# EAGLE design arduinoSPIprog (EAGLE 6.4)
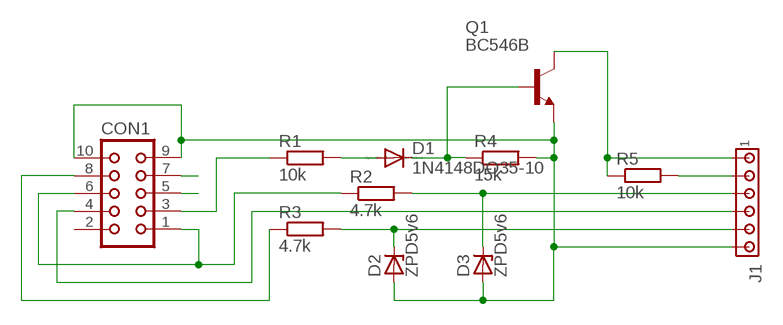
[diagram p0: schematic, sheet 1]

## Parts
CON1  CON10  [CON10]
D1  1N4148DO35-10  [DO35-10]
D2  ZPD5v6  ZPD  [DO35Z10]
D3  ZPD5v6  ZPD  [DO35Z10]
J1  MTA06-100  [10X06MTA]
Q1  BC546B  [TO92-EBC]
R1  10k  R-EU_0207/10  [0207/10]
R2  4.7k  R-EU_0207/10  [0207/10]
R3  4.7k  R-EU_0207/10  [0207/10]
R4  15k  R-EU_0207/10  [0207/10]
R5  10k  R-EU_0207/10  [0207/10]

## Nets
5V: J1.5 R5.2
CTS/MISO: CON1.4 J1.3
DSR+RTS/SCK: CON1.1 CON1.6 R2.1
DTR/MOSI: CON1.8 R3.1
GND: CON1.9 CON1.10 D2.A D3.A J1.1 Q1.E R4.2
MOSI: D2.C J1.2 R3.2
N$1: D1.A R1.2
N$2: D1.C Q1.B R4.1
RESET: J1.6 Q1.C R5.1
RI: CON1.7
RXD: CON1.5
SCK: D3.C J1.4 R2.2
TXD/RESET: CON1.3 R1.1
Unconnected: CON1.2

## Library data of the parts
CON1 = con-harting:CON10: CONNECTOR; OC_FARNELL: unknown; OC_NEWARK: unknown
D1 = diode:1N4148: DIODE high speed (Philips)
D2 D3 = diode:ZPD: Z DIODE 500 mW
J1 = con-amp:MTA06-100: AMP connector
Q1 = transistor-npn:BC546*: NPN Transistor
R1-R5 = rcl:R-EU_: RESISTOR, European symbol

## Board
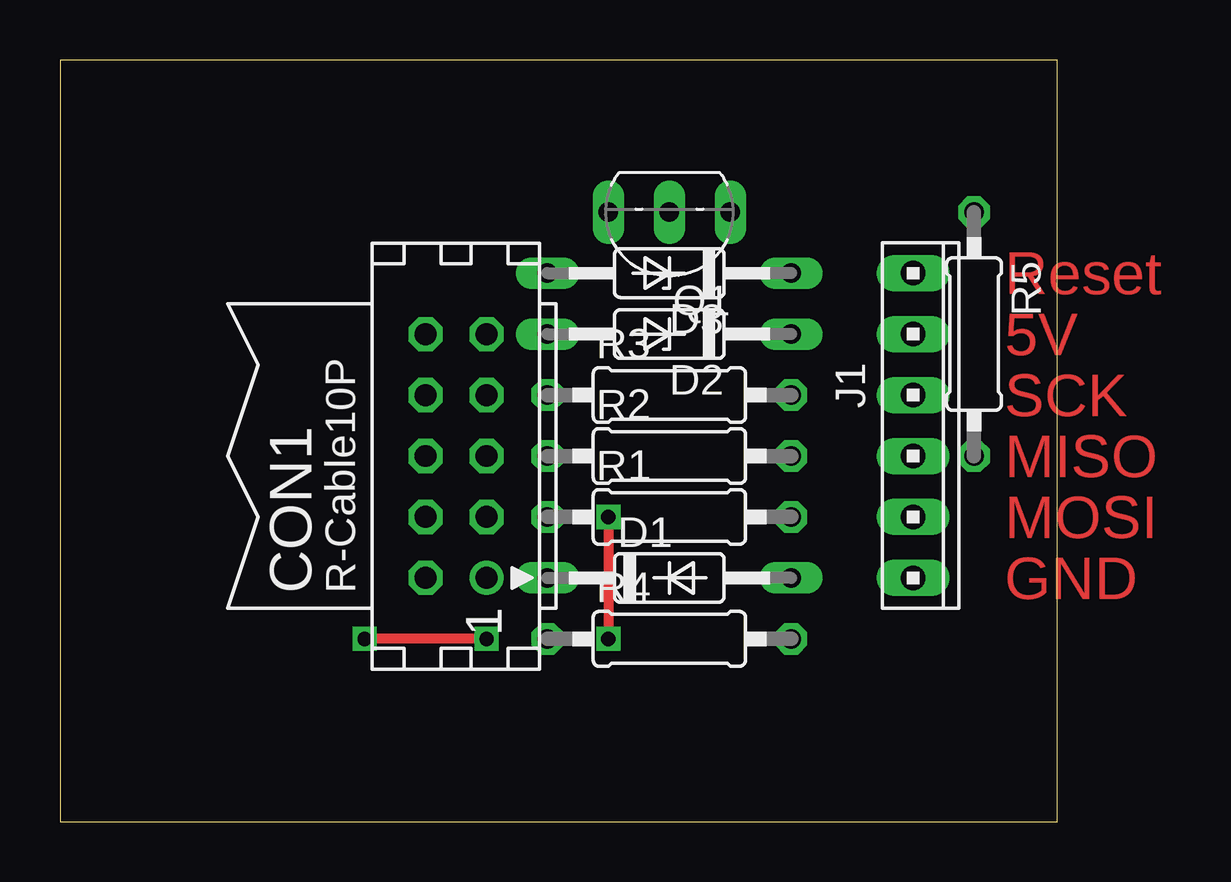
[diagram p1: board, top side]
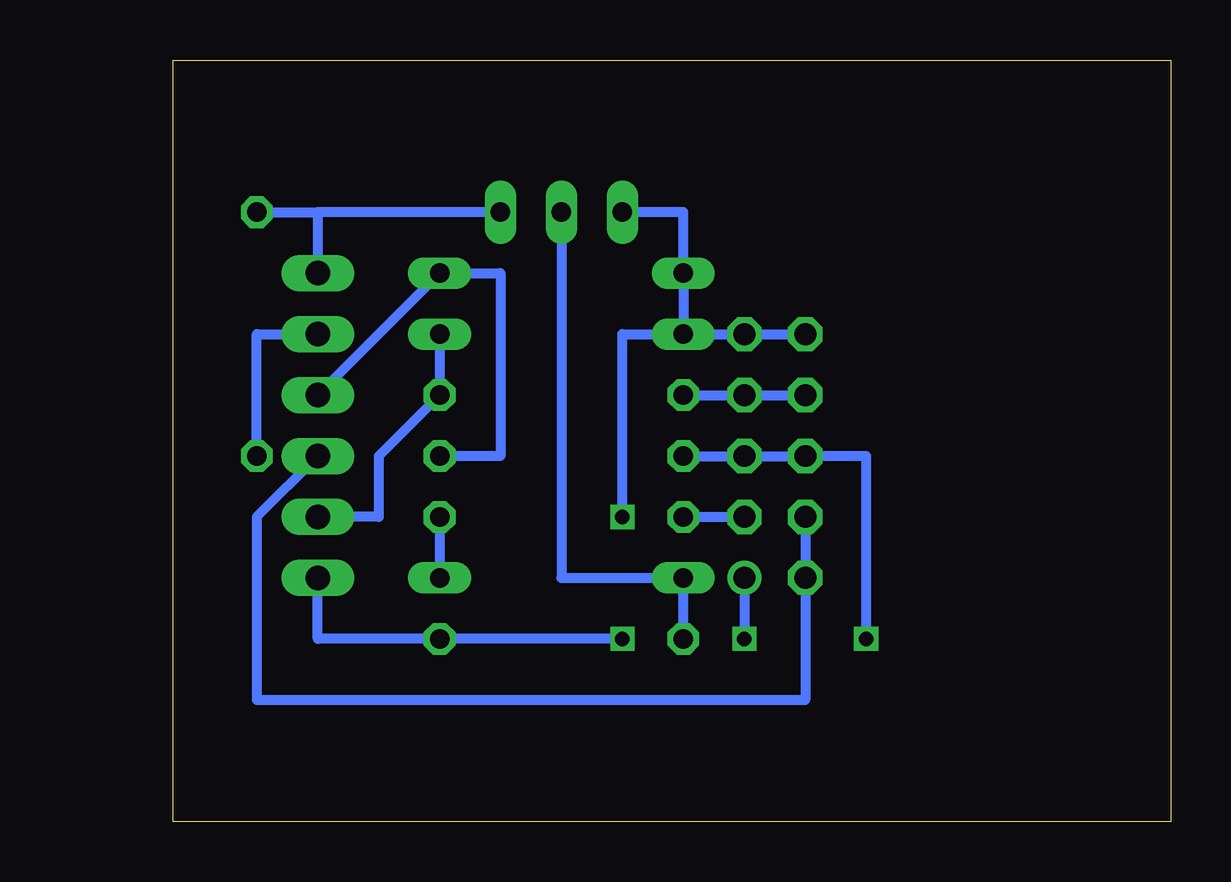
[diagram p2: board, bottom side, seen from below]

Size 41.58 x 31.74 mm. Coordinates in mm from the lower left corner, seen from the top.
Outline: 0,0 41.58,0 41.58,31.74 0,31.74 0,0
Copper layers (1*16): Top 0.035mm / dielectric 1.5mm / Bottom 0.035mm
Design rules "default": minimum track width 10mil, minimum drill 24mil, track to track 8mil, track to pad 8mil, pad to pad 8mil, via to via 8mil, smd to smd 8mil, copper to edge 40mil, drill to drill 8mil, minimum pad ring 10mil, minimum via ring 8mil, stop-mask expansion 4mil, vias tented up to drill 0mil, thermal gap 10mil

### Footprints (pad centres in the part's own frame; a part is rotated, then mirrored left to right if it is on the bottom)
CON10 = drill 0.914: 1 -5.08,-1.27 | drill 0.914 octagon: 2 -5.08,1.27; 3 -2.54,-1.27; 4 -2.54,1.27; 5 0,-1.27; 6 0,1.27; 7 2.54,-1.27; 8 2.54,1.27; 9 5.08,-1.27; 10 5.08,1.27
DO35-10 = drill 0.813 long: A 5.08,0; C -5.08,0
DO35Z10 = drill 0.813 long: A 5.08,0; C -5.08,0
10X06MTA = drill 1.016 long: 1 6.35,0; 2 3.81,0; 3 1.27,0; 4 -1.27,0; 5 -3.81,0; 6 -6.35,0
TO92-EBC = drill 0.813 long: B 0,-1.27; C -2.54,-1.27; E 2.54,-1.27
0207/10 = drill 0.813 octagon: 1 -5.08,0; 2 5.08,0

### Placement (x,y rotation side)
CON1  16.51,15.24 90 top
D1  25.4,10.16 0 top
D2  25.4,20.32 180 top
D3  25.4,22.86 180 top
J1  35.56,16.51 270 top
Q1  25.4,24.13 180 top
R1  25.4,12.7 0 top
R2  25.4,15.24 0 top
R3  25.4,17.78 0 top
R4  25.4,7.62 0 top
R5  38.1,20.32 270 top

### Tracks (layer width: path | path; a pad name or v marks a point on that pad's centre or on a via)
5V
  Bottom 0.406: R5.2 38.1,20.32 J1.5
CTS/MISO
  Bottom 0.406: CON1.4 15.24,5.08 38.1,5.08 38.1,12.7 J1.3
DSR+RTS/SCK  (via drill 0.6)
  Top 0.406: v17.78,7.62 v12.7,7.62
  Bottom 0.406: R2.1 CON1.6 12.7,15.24 v12.7,7.62 | CON1.1 v17.78,7.62
DTR/MOSI
  Bottom 0.406: R3.1 CON1.8
GND  (via drill 0.6)
  Top 0.406: v22.86,12.7 v22.86,7.62
  Bottom 0.406: D2.A D3.A 20.32,25.4 Q1.E | D2.A CON1.9 CON1.10 | v22.86,7.62 R4.2 35.56,7.62 J1.1 | v22.86,12.7 22.86,20.32 D2.A
MOSI
  Bottom 0.406: D2.C R3.2 33.02,15.24 33.02,12.7 J1.2
N$1
  Bottom 0.406: R1.2 D1.A
N$2
  Bottom 0.406: R4.1 D1.C 25.4,10.16 Q1.B
RESET
  Bottom 0.406: Q1.C 35.56,25.4 | R5.1 35.56,25.4 | 35.56,25.4 J1.6
SCK
  Bottom 0.406: R2.2 27.94,15.24 27.94,22.86 D3.C J1.4
TXD/RESET
  Bottom 0.406: R1.1 CON1.3

### Text on the board
Top: Reset | 5V | SCK | MISO | MOSI | GND